# EAGLE design Driver (EAGLE 8.2.0)
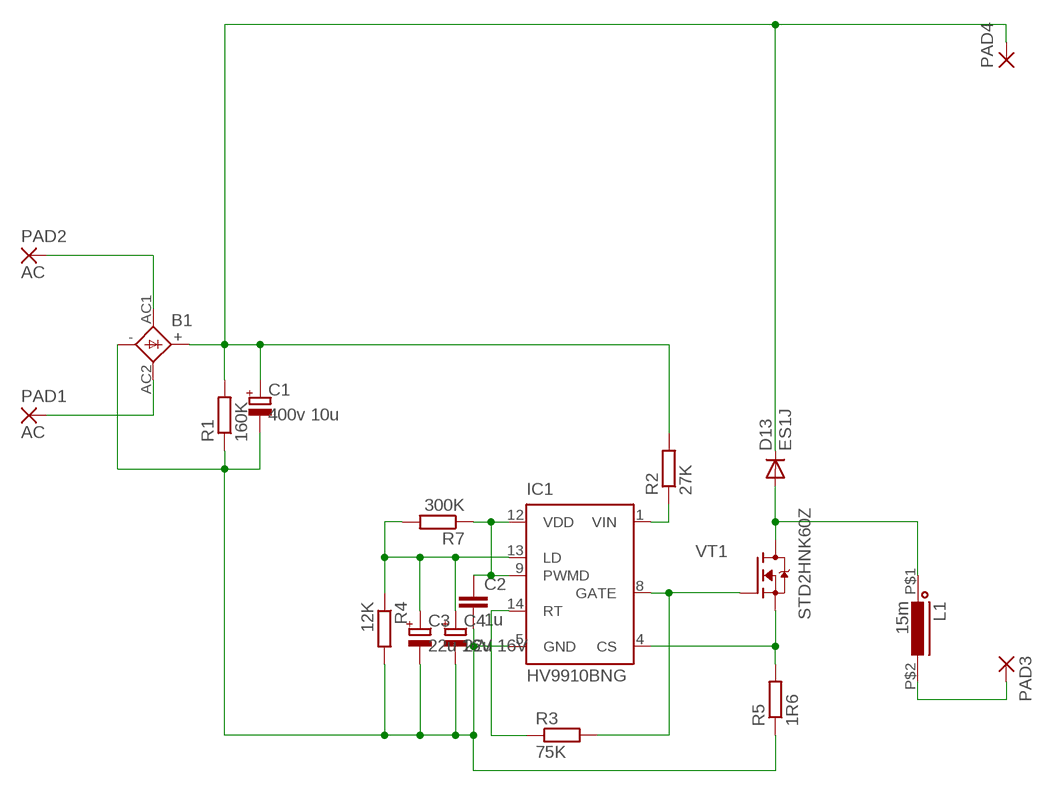
[diagram p0: schematic, sheet 1]

## Parts
B1  BRIDGEMBS  [MBS]
C1  400v 10u  CAP-POL_E3.5-8  [E3,5-8]
C2  1u  CAP_0805  [C0805]
C3  22u 16V  CAP-POL_3528  [CT3528]
C4  22u 16V  CAP-POL_3528  [CT3528]
D13  ES1J  DIODE_ES1J  [DO214AC]
IC1  HV9910BNG  [SOIC-16NG]
L1  15m  INDUCTORSL1016  [SL1016]
PAD1  AC  SMD5  [SMD2,54-5,08]
PAD2  AC  SMD5  [SMD2,54-5,08]
PAD3  SMD5  [SMD2,54-5,08]
PAD4  SMD5  [SMD2,54-5,08]
R1  160K  R_MF-0125  [MF-0125]
R2  27K  R_MF-2  [MF-2]
R3  75K  R_0805  [R0805]
R4  12K  R_0805  [R0805]
R5  1R6  R_MF-05  [MF-05]
R7  300K  R_0805  [R0805]
VT1  STD2HNK60Z  FET-NDPAK  [DPAK]

## Nets
N$12: B1.AC1 PAD2.1(P)
N$13: B1.AC2 PAD1.1(P)
N$14: B1.- C1.- C2.2 C3.- C4.- IC1.5(GND) R1.1 R4.2 R5.1
N$15: C3.+ C4.+ IC1.13(LD) R4.1 R7.2
N$17: B1.+ C1.+ D13.C PAD4.1(P) R1.2 R2.2
N$18: IC1.1(VIN) R2.1
N$19: IC1.4(CS) R5.2 VT1.S
N$20: IC1.14(RT) R3.1
N$21: IC1.8(GATE) R3.2 VT1.G
N$22: L1.P$2 PAD3.1(P)
N$23: D13.A L1.P$1 VT1.D
N$25: C2.1 IC1.9(PWMD) IC1.12(VDD) R7.1

## Library data of the parts
B1 = Namenlos:BRIDGE: GENERAL INSTRUMENT RECTIFIER
C1 C3 C4 = Namenlos:CAP-POL_
C2 = Namenlos:CAP_
D13 = Namenlos:DIODE_
IC1 = Namenlos:HV9910B: Universal High Brightness LED Driver Source: www.supertex.com .. led_driver_ics_SG.pdf; OC_FARNELL: unknown; OC_NEWARK: unknown
L1 = Namenlos:INDUCTOR
PAD1-PAD4 = wirepad:SMD5: SMD PAD
R1-R5 R7 = Namenlos:R_
VT1 = Namenlos:FET-N

## Board
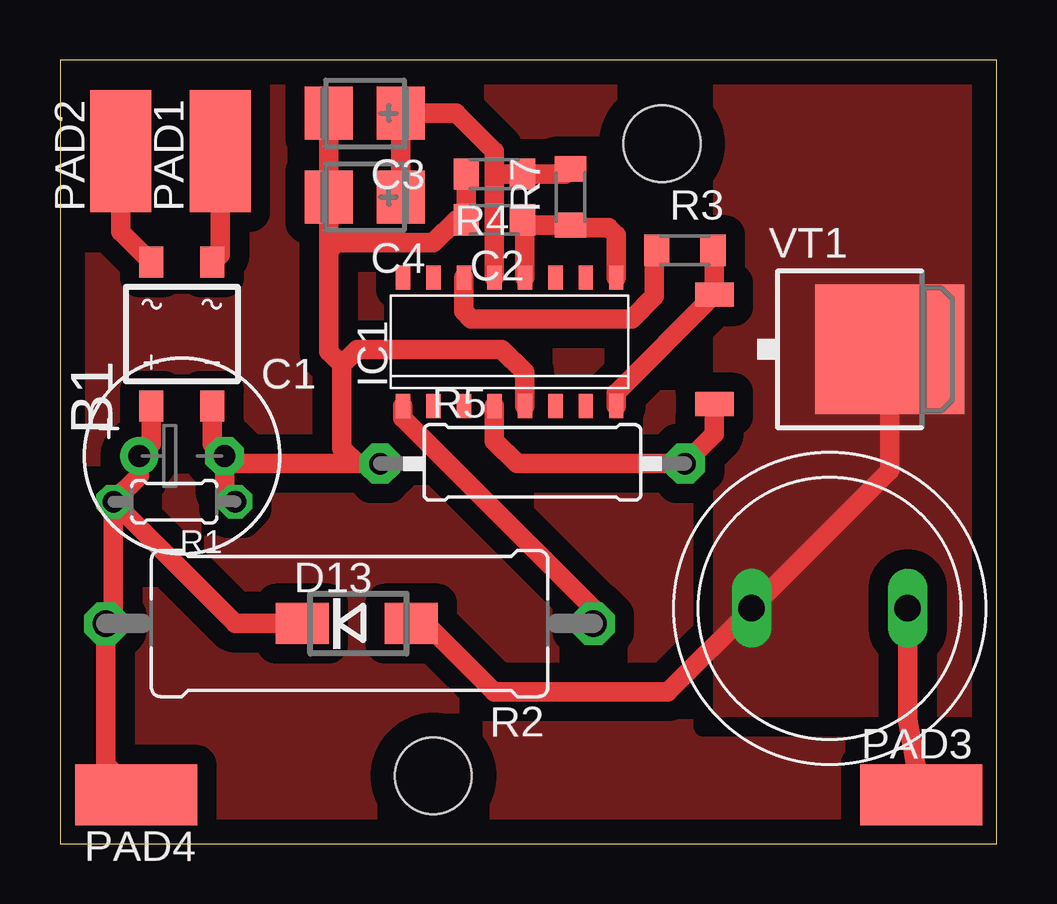
[diagram p1: board, top side]

Size 39.04 x 32.68 mm. Coordinates in mm from the lower left corner, seen from the top.
Outline: 0,32.68 0,0 39.04,0 39.04,32.68 0,32.68
Copper layers (1*16): Top 0.035mm / dielectric 1.5mm / Bottom 0.035mm
Design rules "default": minimum track width 6mil, minimum drill 0.35mm, track to track 6mil, track to pad 6mil, pad to pad 6mil, via to via 6mil, smd to smd 6mil, copper to edge 40mil, drill to drill 6mil, minimum pad ring 10mil, minimum via ring 8mil, stop-mask expansion 4mil, vias tented up to drill 0mil, thermal gap 10mil
Holes 3.2 mm at 25.08,29.19 15.56,2.84

### Footprints (pad centres in the part's own frame; a part is rotated, then mirrored left to right if it is on the bottom)
MBS = smd 1 x 1.3: + -1.27,-3; - 1.27,-3; AC1 -1.27,3; AC2 1.27,3
E3,5-8 = drill 0.9 pad 1.6: + -1.778,0 | drill 0.9 pad 1.6 octagon: - 1.778,0
C0805 = smd 1.05 x 1.3: 1 -1.175,0; 2 1.175,0
CT3528 = smd 2 x 2.2: + -1.5,0; - 1.5,0
DO214AC = smd 2.2 x 1.7: A 2.25,0; C -2.285,0
SOIC-16NG = smd 0.6 x 1: 1 -4.445,-2.675; 2 -3.175,-2.675; 3 -1.905,-2.675; 4 -0.635,-2.675; 5 0.635,-2.675; 6 1.905,-2.675; 7 3.175,-2.675; 8 4.445,-2.675; 9 4.445,2.675; 10 3.175,2.675; 11 1.905,2.675; 12 0.635,2.675; 13 -0.635,2.675; 14 -1.905,2.675; 15 -3.175,2.675; 16 -4.445,2.675
SL1016 = drill 1.1 long: P$1 3.25,0; P$2 -3.25,0
SMD2,54-5,08 = smd 2.54 x 5.08: 1 0,0
MF-0125 = drill 0.9 octagon: 1 -2.54,0; 2 2.54,0
MF-2 = drill 1.1 pad 1.778 octagon: 1 -10.16,0; 2 10.16,0
R0805 = smd 1.05 x 1.3: 1 -1.175,0; 2 1.175,0
MF-05 = drill 0.9 pad 1.676 octagon: 1 -6.35,0; 2 6.35,0
DPAK = smd 5.4 x 6.2: D 0,2.5 | smd 1 x 1.6: G -2.28,-4.8; S 2.28,-4.8

### Placement (x,y rotation side)
B1  5.08,21.25 0 top
C1  5.08,16.17 0 top
C2  18.1,26.02 180 top
C3  12.7,30.46 180 top
C4  12.7,26.97 180 top
D13  12.38,9.19 0 top
IC1  18.73,20.93 0 top
L1  32.07,9.82 180 top
PAD1  6.67,28.87 0 top
PAD2  2.54,28.87 0 top
PAD3  35.88,2.04 270 top
PAD4  3.17,2.04 90 top
R1  4.76,14.27 180 top
R2  12.06,9.19 180 top
R3  26.04,24.75 0 top
R4  18.1,27.92 180 top
R5  19.68,15.86 0 top
R7  21.27,26.97 90 top
VT1  32.07,20.62 270 top

### Tracks (layer width: path | path; a pad name or v marks a point on that pad's centre or on a via)
N$1
  pour Top (isolate 0.813, rank 2): 39.05,32.36 39.05,-0.02 0.32,-0.02 0,-0.34 0,32.68 38.73,32.68
N$12
  Top 0.813: PAD2.1 2.54,25.52 B1.AC1
N$13
  Top 0.813: PAD1.1 6.67,24.57 B1.AC2
N$14
  Top 0.813: B1.- 6.35,16.68 C1.- | C1.- 6.86,14.71 R1.1 | C1.- 7.18,15.86 R5.1 12.38,15.86 11.75,16.49 11.75,19.98 | 11.75,19.98 12.38,20.62 18.41,20.62 19.37,19.66 IC1.5 | 11.2,24.75 C4.- C3.- | 11.2,24.75 11.2,20.53 11.75,19.98 | R4.2 C2.2 16.51,26.02 15.56,25.06 11.52,25.06 11.2,24.75
N$15
  Top 0.813: C4.+ C3.+ 16.51,30.46 18.1,28.87 18.1,27.92 | 18.1,27.92 IC1.13 | 18.1,27.92 R4.1 21.05,27.92 R7.2
N$17
  Top 0.813: B1.+ 3.81,16.68 C1.+ 3.3,15.35 R1.2 | R1.2 2.22,9.51 R2.2 1.91,3.31 PAD4.1 | D13.C 7.3,9.19 R1.2
N$18
  Top 0.813: IC1.1 14.29,17.76 22.23,9.82 R2.1
N$19
  Top 0.813: VT1.S 27.27,17.09 R5.2 19.05,15.86 18.1,16.81 IC1.4
N$20
  Top 0.813: IC1.14 16.83,22.21 17.14,21.89 23.81,21.89 24.77,22.84 24.77,24.65 R3.1
N$21
  Top 0.813: IC1.8 23.18,18.81 VT1.G 27.27,24.69 R3.2
N$22
  Top 0.813: PAD3.1 35.32,5.14 L1.P$2
N$23
  Top 0.813: D13.A 15.24,9.19 18.1,6.33 25.32,6.33 L1.P$1 34.57,15.57 VT1.D
  pour Top (isolate 0.813, no thermals): 39.05,32.68 39.05,6.01 39.37,5.7 27.62,5.7 27.62,32.68
N$25
  Top 0.813: IC1.12 19.37,25.92 C2.1 19.5,25.79 R7.1 21.37,25.7 22.86,25.7 23.18,25.38 IC1.9